# EAGLE schematic Testing_board_CIDIC_rev_aamaya (EAGLE 7.5.0)
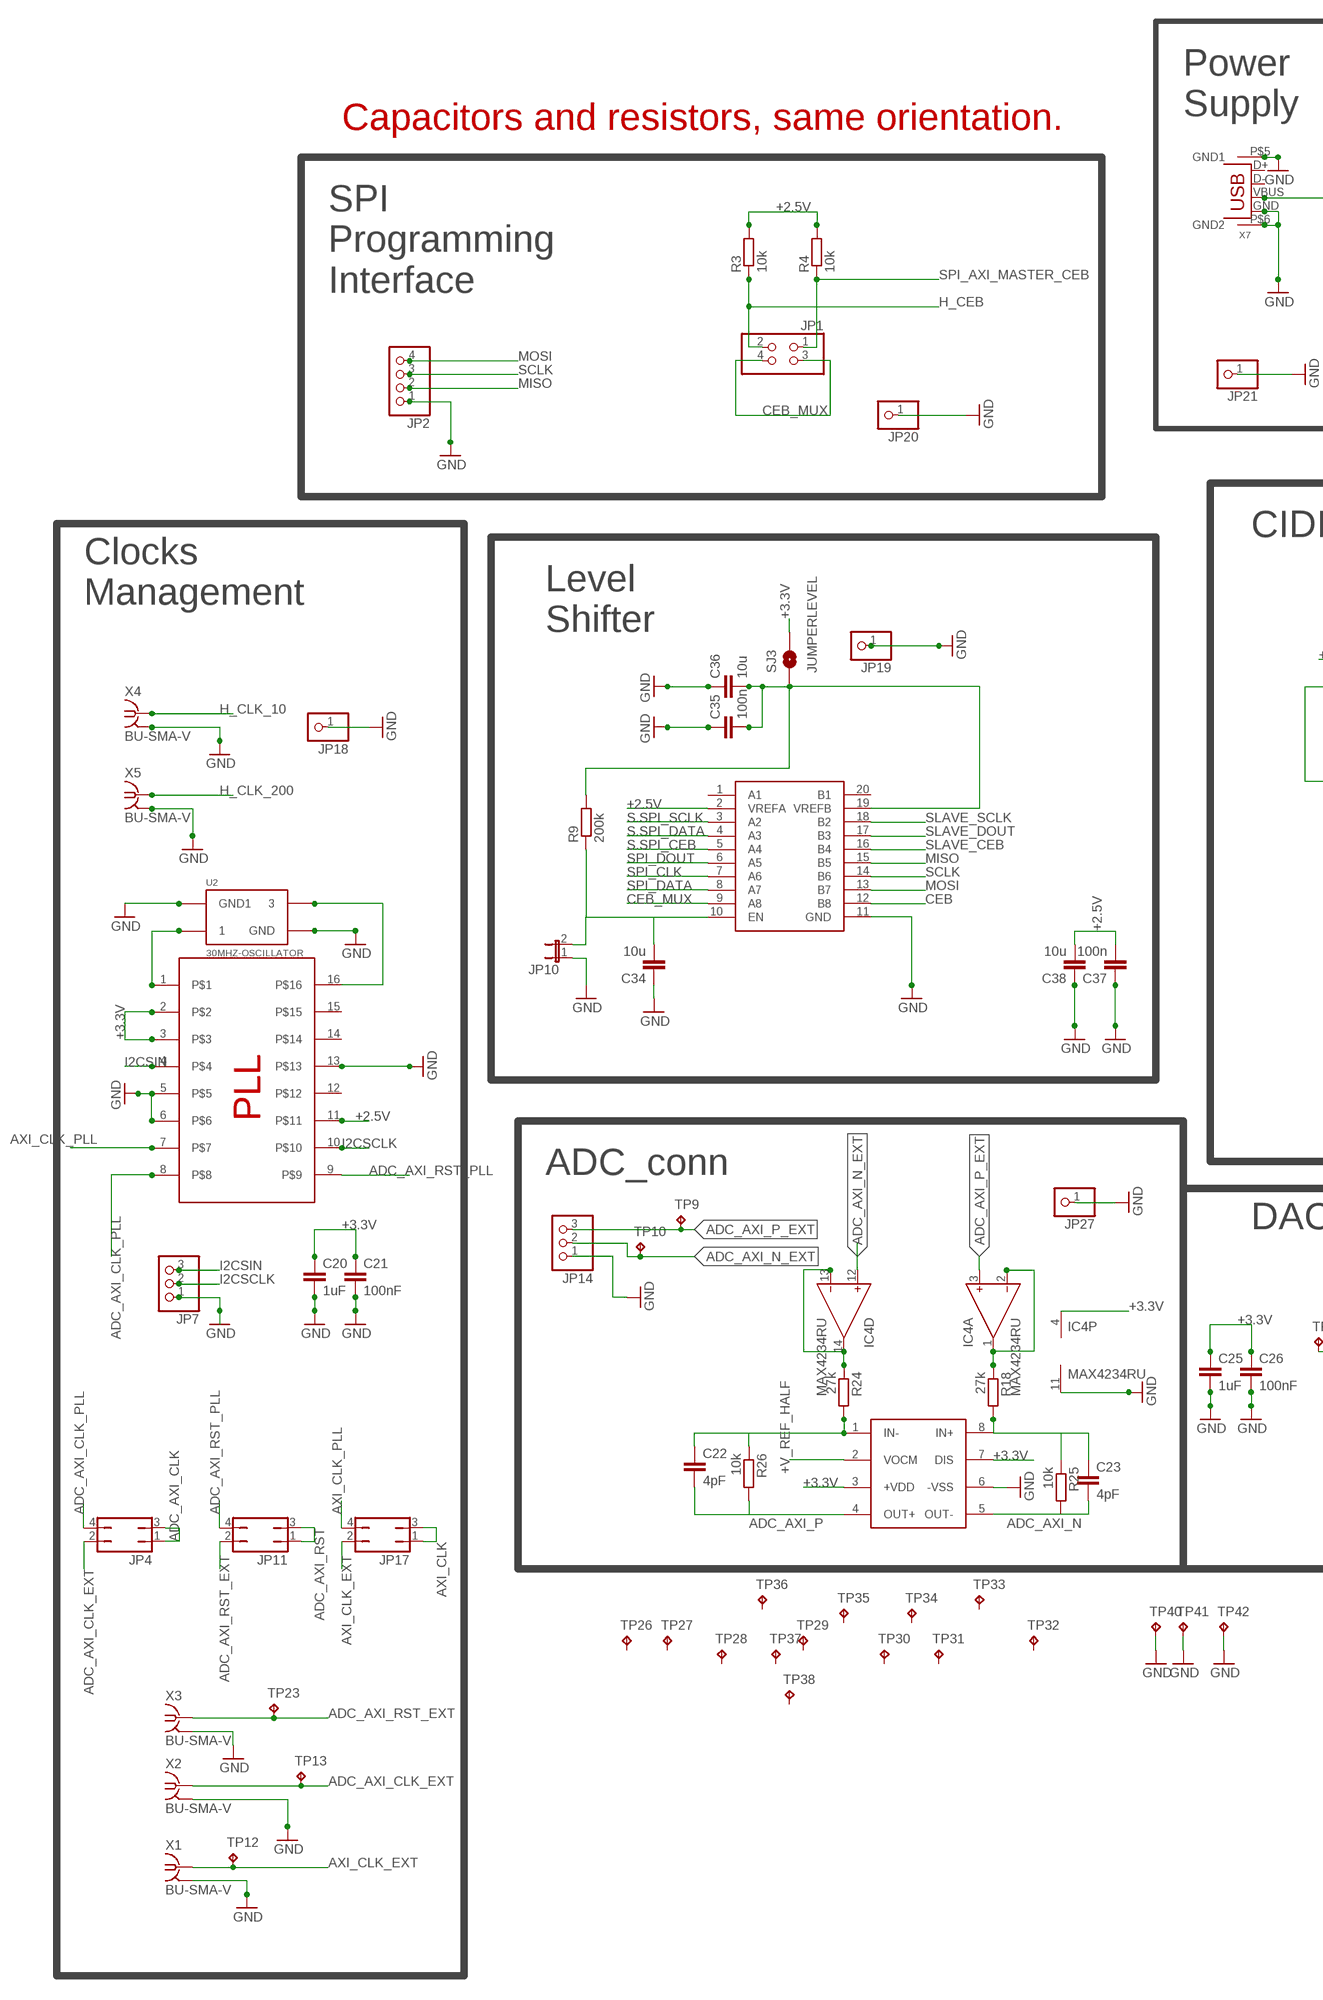
[diagram p0: schematic, sheet 1, part 1 of 2]
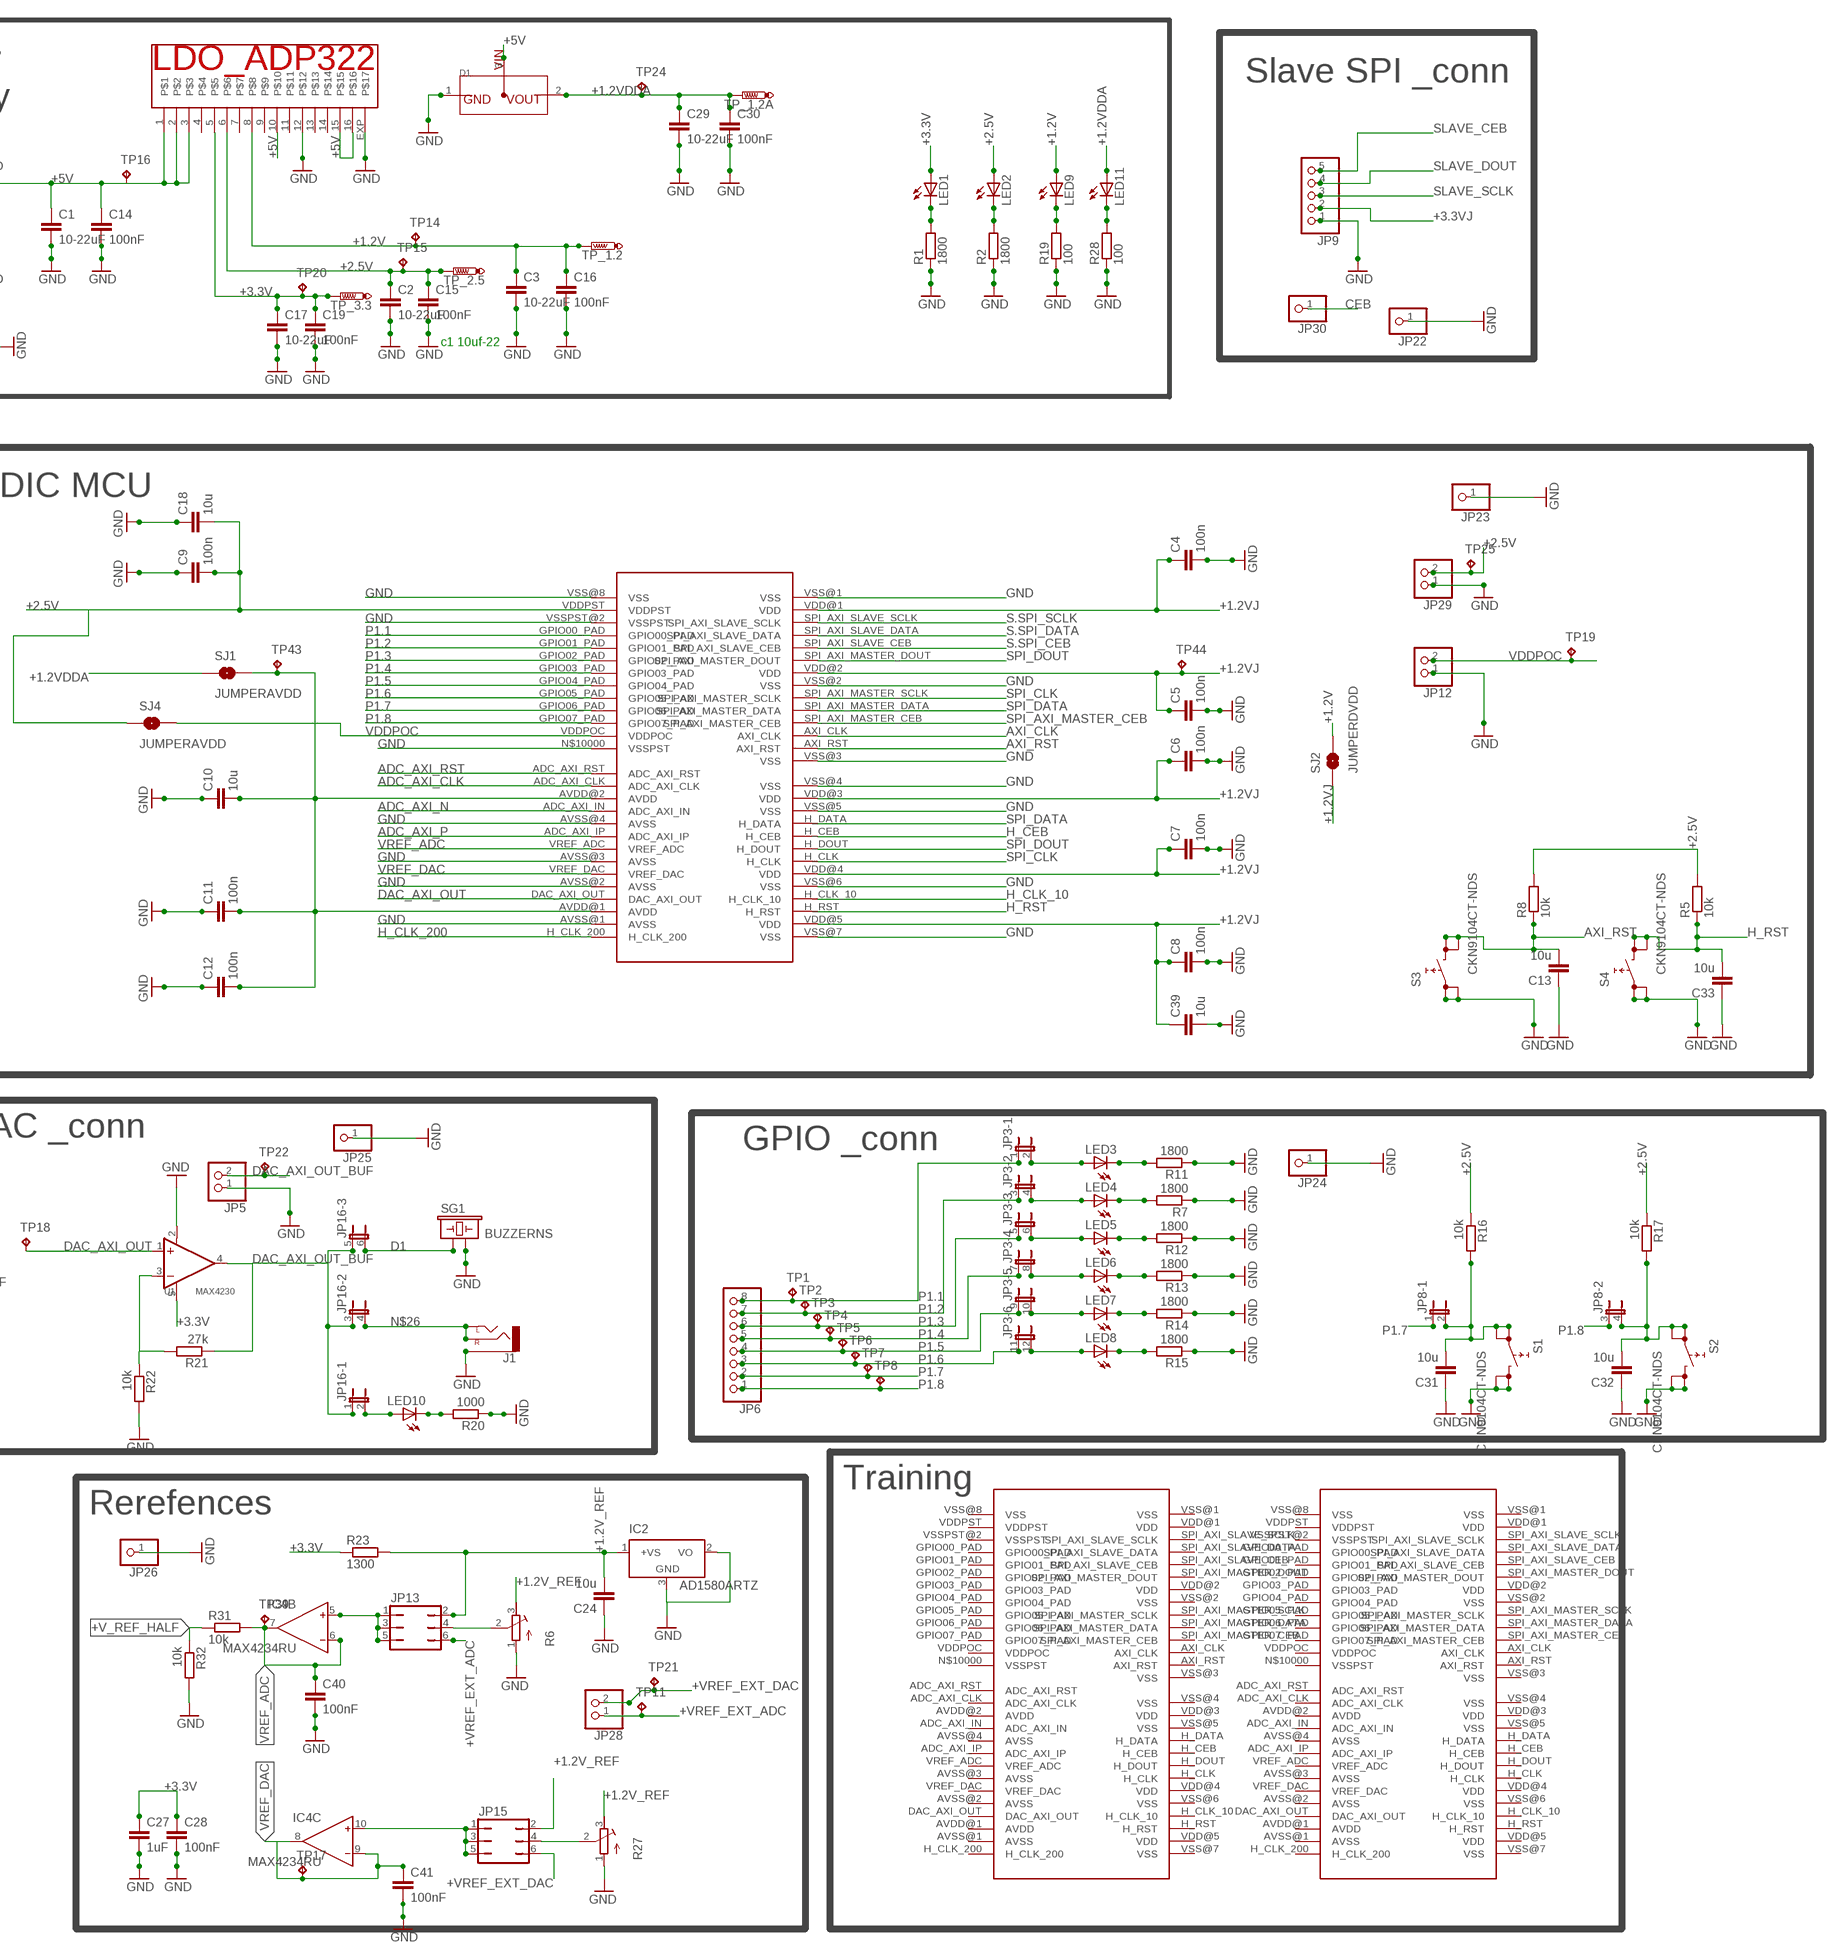
[diagram p1: schematic, sheet 1, part 2 of 2]

## Parts
C1  10-22uF  C-EUC0603  [C0603]
C2  10-22uF  C-EUC0603  [C0603]
C3  10-22uF  C-EUC0603  [C0603]
C4  100n  C-EUC0603  [C0603]
C5  100n  C-EUC0603  [C0603]
C6  100n  C-EUC0603  [C0603]
C7  100n  C-EUC0603  [C0603]
C8  100n  C-EUC0603  [C0603]
C9  100n  C-EUC0603  [C0603]
C10  10u  C-EUC0603  [C0603]
C11  100n  C-EUC0603  [C0603]
C12  100n  C-EUC0603  [C0603]
C13  10u  C-EUC0603  [C0603]
C14  100nF  C-EUC0603  [C0603]
C15  100nF  C-EUC0603  [C0603]
C16  100nF  C-EUC0603  [C0603]
C17  10-22uF  C-EUC0603  [C0603]
C18  10u  C-EUC0603  [C0603]
C19  100nF  C-EUC0603  [C0603]
C20  1uF  C-EUC0603  [C0603]
C21  100nF  C-EUC0603  [C0603]
C22  4pF  C-EUC0603  [C0603]
C23  4pF  C-EUC0603  [C0603]
C24  10u  C-EUC0603  [C0603]
C25  1uF  C-EUC0603  [C0603]
C26  100nF  C-EUC0603  [C0603]
C27  1uF  C-EUC0603  [C0603]
C28  100nF  C-EUC0603  [C0603]
C29  10-22uF  C-EUC0603  [C0603]
C30  100nF  C-EUC0603  [C0603]
C31  10u  C-EUC0603  [C0603]
C32  10u  C-EUC0603  [C0603]
C33  10u  C-EUC0603  [C0603]
C34  10u  C-EUC0603  [C0603]
C35  100n  C-EUC0603  [C0603]
C36  10u  C-EUC0603  [C0603]
C37  100n  C-EUC0603  [C0603]
C38  10u  C-EUC0603  [C0603]
C39  10u  C-EUC0603  [C0603]
C40  100nF  C-EUC0603  [C0603]
C41  100nF  C-EUC0603  [C0603]
D1  MCP1700T-1202E/TTCT-ND  [SOT-23]
GND  ADP322  [LFCSP_LQ-16]
IC2  AD1580ARTZ  LM50  [SOT23]
IC4  MAX4234RU  [TSSOP14]
J1  AUDIO-JACK_DIGIKEYSMD  [STEREOJACK2.5MM_SMD]
JP1  PINHD-2X2  [2X02]
JP2  PINHD-1X4  [1X04]
JP3  JP6QE  [JP6Q]
JP4  JP2Q  [JP2Q]
JP5  PINHD-1X2  [1X02]
JP6  PINHD-1X8  [1X08]
JP7  PINHD-1X3  [1X03]
JP8  JP2QE  [JP2Q]
JP9  PINHD-1X5  [1X05]
JP10  JP1E  [JP1]
JP11  JP2Q  [JP2Q]
JP12  PINHD-1X2  [1X02]
JP13  JP3Q  [JP3Q]
JP14  PINHD-1X3  [1X03]
JP15  JP3Q  [JP3Q]
JP16  JP3QE  [JP3Q]
JP17  JP2Q  [JP2Q]
JP18  PINHD-1X1  [1X01]
JP19  PINHD-1X1  [1X01]
JP20  PINHD-1X1  [1X01]
JP21  PINHD-1X1  [1X01]
JP22  PINHD-1X1  [1X01]
JP23  PINHD-1X1  [1X01]
JP24  PINHD-1X1  [1X01]
JP25  PINHD-1X1  [1X01]
JP26  PINHD-1X1  [1X01]
JP27  PINHD-1X1  [1X01]
JP28  PINHD-1X2  [1X02]
JP29  PINHD-1X2  [1X02]
JP30  PINHD-1X1  [1X01]
LED1  LEDSML0805  [SML0805]
LED2  LEDSML0805  [SML0805]
LED3  LEDCHIPLED_0805  [CHIPLED_0805]
LED4  LEDCHIPLED_0805  [CHIPLED_0805]
LED5  LEDCHIPLED_0805  [CHIPLED_0805]
LED6  LEDCHIPLED_0805  [CHIPLED_0805]
LED7  LEDCHIPLED_0805  [CHIPLED_0805]
LED8  LEDCHIPLED_0805  [CHIPLED_0805]
LED9  LEDSML0805  [SML0805]
LED10  LEDSML0805  [SML0805]
LED11  LEDSML0805  [SML0805]
R1  1800  R-EU_R0603  [R0603]
R2  1800  R-EU_R0603  [R0603]
R3  10k  R-EU_R0603  [R0603]
R4  10k  R-EU_R0603  [R0603]
R5  10k  R-EU_R0603  [R0603]
R6  R-TRIMM4G/J  [RTRIM4G/J]
R7  1800  R-EU_R0603  [R0603]
R8  10k  R-EU_R0603  [R0603]
R9  200k  R-EU_R0603  [R0603]
R11  1800  R-EU_R0603  [R0603]
R12  1800  R-EU_R0603  [R0603]
R13  1800  R-EU_R0603  [R0603]
R14  1800  R-EU_R0603  [R0603]
R15  1800  R-EU_R0603  [R0603]
R16  10k  R-EU_R0603  [R0603]
R17  10k  R-EU_R0603  [R0603]
R18  27k  R-EU_R0603  [R0603]
R19  100  R-EU_R0603  [R0603]
R20  1000  R-EU_R0603  [R0603]
R21  27k  R-EU_R0603  [R0603]
R22  10k  R-EU_R0603  [R0603]
R23  1300  R-EU_R0603  [R0603]
R24  27k  R-EU_R0603  [R0603]
R25  10k  R-EU_R0603  [R0603]
R26  10k  R-EU_R0603  [R0603]
R27  R-TRIMM4G/J  [RTRIM4G/J]
R28  100  R-EU_R0603  [R0603]
R31  10k  R-EU_R0603  [R0603]
R32  10k  R-EU_R0603  [R0603]
S1  CKN9104CT-NDS  [SKHMPXE010]
S2  CKN9104CT-NDS  [SKHMPXE010]
S3  CKN9104CT-NDS  [SKHMPXE010]
S4  CKN9104CT-NDS  [SKHMPXE010]
SG1  BUZZERNS  [BUZZER-12MM-NS]
SJ1  JUMPERAVDD  SOLDERJUMPERROUND  [SJ_ROUND]
SJ2  JUMPERDVDD  SOLDERJUMPERROUND  [SJ_ROUND]
SJ3  JUMPERLEVEL  SOLDERJUMPERROUND  [SJ_ROUND]
SJ4  JUMPERAVDD  SOLDERJUMPERROUND  [SJ_ROUND]
TP1  TPTP20R  [TP20R]
TP2  TPTP20R  [TP20R]
TP3  TPTP20R  [TP20R]
TP4  TPTP20R  [TP20R]
TP5  TPTP20R  [TP20R]
TP6  TPTP20R  [TP20R]
TP7  TPTP20R  [TP20R]
TP8  TPTP20R  [TP20R]
TP9  TPTP20R  [TP20R]
TP10  TPTP20R  [TP20R]
TP11  TPTP20R  [TP20R]
TP12  TPTP20R  [TP20R]
TP13  TPTP20R  [TP20R]
TP14  TPTP20R  [TP20R]
TP15  TPTP20R  [TP20R]
TP16  TPTP20R  [TP20R]
TP17  TPTP20R  [TP20R]
TP18  TPTP20R  [TP20R]
TP19  TPTP20R  [TP20R]
TP20  TPTP20R  [TP20R]
TP21  TPTP20R  [TP20R]
TP22  TPTP20R  [TP20R]
TP23  TPTP20R  [TP20R]
TP24  TPTP20R  [TP20R]
TP25  TPTP20R  [TP20R]
TP26  TPTP08R  [TP08R]
TP27  TPTP08R  [TP08R]
TP28  TPTP08R  [TP08R]
TP29  TPTP08R  [TP08R]
TP30  TPTP08R  [TP08R]
TP31  TPTP08R  [TP08R]
TP32  TPTP08R  [TP08R]
TP33  TPTP08R  [TP08R]
TP34  TPTP08R  [TP08R]
TP35  TPTP08R  [TP08R]
TP36  TPTP08R  [TP08R]
TP37  TPTP08R  [TP08R]
TP38  TPTP08R  [TP08R]
TP39  TPTP20R  [TP20R]
TP40  TPTP20R  [TP20R]
TP41  TPTP20R  [TP20R]
TP42  TPTP20R  [TP20R]
TP43  TPTP20R  [TP20R]
TP44  TPTP20R  [TP20R]
TP_1.2  PTR1B1,27  [B1,27]
TP_1.2A  PTR1B1,27  [B1,27]
TP_2.5  PTR1B1,27  [B1,27]
TP_3.3  PTR1B1,27  [B1,27]
U1  MAX4230  [SC-70-5]
U2  30MHZ-OSCILLATOR  [5X3.2]
U$1  CIDIC_AXI_UC_TEST_DIE  [CIDIC_AXI_UC_TEST_DIE]
U$3  LEVEL_SHIFTER_8  [TSSOP20]
U$4  CY22150KFZXC  [TSSOP16]
U$5  ADA4940  [SO8]
U$6  CIDIC_AXI_UC_TEST_DIE  [CIDIC_AXI_UC_TEST_DIE]
U$7  CIDIC_AXI_UC_TEST_DIE  [CIDIC_AXI_UC_TEST_DIE]
X1  BU-SMA-V  [BU-SMA-V]
X2  BU-SMA-V  [BU-SMA-V]
X3  BU-SMA-V  [BU-SMA-V]
X4  BU-SMA-V  [BU-SMA-V]
X5  BU-SMA-V  [BU-SMA-V]
X7  USB-A-H  [USB-A-H]

## Nets
+1.2V: C3.1 C16.1 GND.8 LED9.A SJ2.2 TP14.TP TP_1.2.TP
+1.2V_REF: C24.2 IC2.1(+VS) JP13.2 JP15.2 R6.3(E) R23.2 R27.3(E)
+1.2VDDA: C29.1 C30.1 D1.2(VOUT) LED11.A SJ1.1 TP24.TP TP_1.2A.TP
+1.2VJ: C4.1 C5.1 C6.1 C7.1 C8.1 C39.1 SJ2.1 TP44.TP U$1.VDD@1(VDD) U$1.VDD@2(VDD) U$1.VDD@3(VDD) U$1.VDD@4(VDD) U$1.VDD@5(VDD)
+2.5V: C2.1 C9.2 C15.1 C18.2 C37.2 C38.2 GND.6 JP29.2 LED2.A R3.2 R4.2 R5.2 R8.2 R16.1 R17.1 SJ4.1 TP15.TP TP25.TP TP_2.5.TP U$1.VDDPST U$3.2(VREFA) U$4.11
+3.3V: C17.1 C19.1 C20.1 C21.1 C25.1 C26.1 C27.1 C28.1 GND.5 IC4.4(P:V+) LED1.A R23.1 SJ3.2 TP20.TP TP_3.3.TP U1.5(V+) U$4.2 U$4.3 U$5.3(+VDD) U$5.7(DIS)
+3.3VJ: C35.2 C36.2 JP9.2 R9.2 SJ3.1 U$3.19(VREFB)
+5V: C1.1 C14.1 D1.3(VIN) GND.1 GND.2 GND.3 GND.10 GND.15 GND.16 TP16.TP X7.VBUS
+V_REF_HALF: R31.1 R32.1 U$5.2(VOCM)
+VREF_EXT_ADC: JP13.6 JP28.1 TP11.TP
+VREF_EXT_DAC: JP15.6 JP28.2 TP21.TP
ADC_AXI_CLK: JP4.1 JP4.3 U$1.ADC_AXI_CLK
ADC_AXI_CLK_EXT: JP4.2 TP13.TP X2.1
ADC_AXI_CLK_PLL: JP4.4 U$4.8
ADC_AXI_N: C23.2 R25.2 U$1.ADC_AXI_IN U$5.5(OUT-)
ADC_AXI_N_EXT: IC4.12(D:IN+) JP14.2 TP10.TP
ADC_AXI_P: C22.2 R26.2 U$1.ADC_AXI_IP U$5.4(OUT+)
ADC_AXI_P_EXT: IC4.3(A:IN+) JP14.3 TP9.TP
ADC_AXI_RST: JP11.1 JP11.3 U$1.ADC_AXI_RST
ADC_AXI_RST_EXT: JP11.2 TP23.TP X3.1
ADC_AXI_RST_PLL: JP11.4 U$4.9
AXI_CLK: JP17.1 JP17.3 U$1.AXI_CLK
AXI_CLK_EXT: JP17.2 TP12.TP X1.1
AXI_CLK_PLL: JP17.4 U$4.7
AXI_RST: C13.2 R8.1 S3.3(2.1) S3.4(2.2) U$1.AXI_RST
CEB: JP30.1 U$3.12(B8)
CEB_MUX: JP1.3 JP1.4 U$3.9(A8)
D1: JP16.6 SG1.+
D3: JP16.2 LED10.A
DAC_AXI_OUT: TP18.TP U1.1(IN+) U$1.DAC_AXI_OUT
DAC_AXI_OUT_BUF: JP5.2 JP16.1 JP16.3 JP16.5 R21.1 TP22.TP U1.4(OUT)
GND: C1.2 C2.2 C3.2 C4.2 C5.2 C6.2 C7.2 C8.2 C9.1 C10.1 C11.1 C12.1 C13.1 C14.2 C15.2 C16.2 C17.2 C18.1 C19.2 C20.2 C21.2 C24.1 C25.2 C26.2 C27.2 C28.2 C29.2 C30.2 C31.1 C32.1 C33.1 C34.1 C35.1 C36.1 C37.1 C38.1 C39.2 C40.2 C41.2 D1.1(GND) GND.12 GND.EXP IC2.2(VO) IC2.3(GND) IC4.11(P:V-) J1.1(SLEEVE) JP2.1 JP5.1 JP7.1 JP9.1 JP10.1 JP12.1 JP14.1 JP18.1 JP19.1 JP20.1 JP21.1 JP22.1 JP23.1 JP24.1 JP25.1 JP26.1 JP27.1 JP29.1 R1.1 R2.1 R6.1(A) R7.1 R11.1 R12.1 R13.1 R14.1 R15.1 R19.1 R20.1 R22.2 R27.1(A) R28.1 R32.2 S1.3(2.1) S1.4(2.2) S2.3(2.1) S2.4(2.2) S3.1(1.1) S3.2(1.2) S4.1(1.1) S4.2(1.2) SG1.- TP40.TP TP41.TP TP42.TP U1.2(V-) U2.2(GND) U2.4(GND1) U$1.AVSS@1(AVSS) U$1.AVSS@2(AVSS) U$1.AVSS@3(AVSS) U$1.AVSS@4(AVSS) U$1.N$10000(VSSPST) U$1.VSS@1(VSS) U$1.VSS@2(VSS) U$1.VSS@3(VSS) U$1.VSS@4(VSS) U$1.VSS@5(VSS) U$1.VSS@6(VSS) U$1.VSS@7(VSS) U$1.VSS@8(VSS) U$1.VSSPST@2(VSSPST) U$3.11(GND) U$4.5 U$4.6 U$4.13 U$5.6(-VSS) X1.2 X1.3 X1.4 X1.5 X2.2 X2.3 X2.4 X2.5 X3.2 X3.3 X3.4 X3.5 X4.2 X4.3 X4.4 X4.5 X5.2 X5.3 X5.4 X5.5 X7.GND X7.P$5(GND1) X7.P$6(GND2)
H_CEB: JP1.2 R3.1 U$1.H_CEB
H_CLK_10 [diff_pair]: U$1.H_CLK_10 X4.1
H_CLK_200 [diff_pair]: U$1.H_CLK_200 X5.1
H_RST: C33.2 R5.1 S4.3(2.1) S4.4(2.2) U$1.H_RST
I2CSCLK: JP7.2 U$4.10
I2CSIN: JP7.3 U$4.4
JV12A: C10.2 C11.2 C12.2 SJ1.2 TP43.TP U$1.AVDD@1(AVDD) U$1.AVDD@2(AVDD)
MISO: JP2.2 U$3.15(B5)
MOSI: JP2.4 U$3.13(B7)
N$1: U2.1 U$4.1
N$2: LED1.C R1.2
N$3: LED2.C R2.2
N$4: C22.1 R24.2 R26.1 U$5.1(IN-)
N$5: LED9.C R19.2
N$6: C31.2 JP8.2 R16.2 S1.1(1.1) S1.2(1.2)
N$7: C32.2 JP8.4 R17.2 S2.1(1.1) S2.2(1.2)
N$8: C23.1 R18.2 R25.1 U$5.8(IN+)
N$9: U2.3 U$4.16
N$10: JP13.4 R6.2(S)
N$12: LED11.C R28.2
N$13: IC4.13(D:IN-) IC4.14(D:OUT) R24.1
N$14: LED4.C R7.2
N$15: JP3.4 LED4.A
N$16: JP3.6 LED5.A
N$17: JP3.8 LED6.A
N$18: JP3.10 LED7.A
N$19: JP3.2 LED3.A
N$20: LED3.C R11.2
N$21: JP3.12 LED8.A
N$22: LED5.C R12.2
N$23: LED6.C R13.2
N$24: LED7.C R14.2
N$25: LED8.C R15.2
N$26: J1.2(LEFT) J1.3(RIGHT) JP16.4
N$27: IC4.1(A:OUT) IC4.2(A:IN-) R18.1
N$29: R21.2 R22.1 U1.3(IN-)
N$31: LED10.C R20.2
N$33: IC4.10(C:IN+) JP15.1 JP15.3 JP15.5
N$36: IC4.5(B:IN+) JP13.1 JP13.3 JP13.5
N$37: JP15.4 R27.2(S)
N$53: C34.2 JP10.2 R9.1 U$3.10(EN)
P1.1: JP3.1 JP6.8 TP1.TP U$1.GPIO00_PAD
P1.2: JP3.3 JP6.7 TP2.TP U$1.GPIO01_PAD
P1.3: JP3.5 JP6.6 TP3.TP U$1.GPIO02_PAD
P1.4: JP3.7 JP6.5 TP4.TP U$1.GPIO03_PAD
P1.5: JP3.9 JP6.4 TP5.TP U$1.GPIO04_PAD
P1.6: JP3.11 JP6.3 TP6.TP U$1.GPIO05_PAD
P1.7: JP6.2 JP8.1 TP7.TP U$1.GPIO06_PAD
P1.8: JP6.1 JP8.3 TP8.TP U$1.GPIO07_PAD
S.SPI_CEB: U$1.SPI_AXI_SLAVE_CEB U$3.5(A4)
S.SPI_DATA: U$1.SPI_AXI_SLAVE_DATA U$3.4(A3)
S.SPI_SCLK: U$1.SPI_AXI_SLAVE_SCLK U$3.3(A2)
SCLK: JP2.3 U$3.14(B6)
SLAVE_CEB: JP9.5 U$3.16(B4)
SLAVE_DOUT: JP9.4 U$3.17(B3)
SLAVE_SCLK: JP9.3 U$3.18(B2)
SPI_AXI_MASTER_CEB: JP1.1 R4.1 U$1.SPI_AXI_MASTER_CEB
SPI_CLK: U$1.H_CLK U$1.SPI_AXI_MASTER_SCLK U$3.7(A6)
SPI_DATA: U$1.H_DATA U$1.SPI_AXI_MASTER_DATA U$3.8(A7)
SPI_DOUT: U$1.H_DOUT U$1.SPI_AXI_MASTER_DOUT U$3.6(A5)
VDDPOC: JP12.2 SJ4.2 TP19.TP U$1.VDDPOC
VREF_ADC: C40.1 IC4.6(B:IN-) IC4.7(B:OUT) R31.2 TP39.TP U$1.VREF_ADC
VREF_DAC: C41.1 IC4.8(C:OUT) IC4.9(C:IN-) TP17.TP U$1.VREF_DAC
Unconnected: GND.4 GND.7 GND.9 GND.11 GND.13 GND.14 TP26.TP TP27.TP TP28.TP TP29.TP TP30.TP TP31.TP TP32.TP TP33.TP TP34.TP TP35.TP TP36.TP TP37.TP TP38.TP U$3.1(A1) U$3.20(B1) U$4.12 U$4.14 U$4.15 U$6.ADC_AXI_CLK U$6.ADC_AXI_IN U$6.ADC_AXI_IP U$6.ADC_AXI_RST U$6.AVDD@1(AVDD) U$6.AVDD@2(AVDD) U$6.AVSS@1(AVSS) U$6.AVSS@2(AVSS) U$6.AVSS@3(AVSS) U$6.AVSS@4(AVSS) U$6.AXI_CLK U$6.AXI_RST U$6.DAC_AXI_OUT U$6.GPIO00_PAD U$6.GPIO01_PAD U$6.GPIO02_PAD U$6.GPIO03_PAD U$6.GPIO04_PAD U$6.GPIO05_PAD U$6.GPIO06_PAD U$6.GPIO07_PAD U$6.H_CEB U$6.H_CLK U$6.H_CLK_10 U$6.H_CLK_200 U$6.H_DATA U$6.H_DOUT U$6.H_RST U$6.N$10000(VSSPST) U$6.SPI_AXI_MASTER_CEB U$6.SPI_AXI_MASTER_DATA U$6.SPI_AXI_MASTER_DOUT U$6.SPI_AXI_MASTER_SCLK U$6.SPI_AXI_SLAVE_CEB U$6.SPI_AXI_SLAVE_DATA U$6.SPI_AXI_SLAVE_SCLK U$6.VDD@1(VDD) U$6.VDD@2(VDD) U$6.VDD@3(VDD) U$6.VDD@4(VDD) U$6.VDD@5(VDD) U$6.VDDPOC U$6.VDDPST U$6.VREF_ADC U$6.VREF_DAC U$6.VSS@1(VSS) U$6.VSS@2(VSS) U$6.VSS@3(VSS) U$6.VSS@4(VSS) U$6.VSS@5(VSS) U$6.VSS@6(VSS) U$6.VSS@7(VSS) U$6.VSS@8(VSS) U$6.VSSPST@2(VSSPST) U$7.ADC_AXI_CLK U$7.ADC_AXI_IN U$7.ADC_AXI_IP U$7.ADC_AXI_RST U$7.AVDD@1(AVDD) U$7.AVDD@2(AVDD) U$7.AVSS@1(AVSS) U$7.AVSS@2(AVSS) U$7.AVSS@3(AVSS) U$7.AVSS@4(AVSS) U$7.AXI_CLK U$7.AXI_RST U$7.DAC_AXI_OUT U$7.GPIO00_PAD U$7.GPIO01_PAD U$7.GPIO02_PAD U$7.GPIO03_PAD U$7.GPIO04_PAD U$7.GPIO05_PAD U$7.GPIO06_PAD U$7.GPIO07_PAD U$7.H_CEB U$7.H_CLK U$7.H_CLK_10 U$7.H_CLK_200 U$7.H_DATA U$7.H_DOUT U$7.H_RST U$7.N$10000(VSSPST) U$7.SPI_AXI_MASTER_CEB U$7.SPI_AXI_MASTER_DATA U$7.SPI_AXI_MASTER_DOUT U$7.SPI_AXI_MASTER_SCLK U$7.SPI_AXI_SLAVE_CEB U$7.SPI_AXI_SLAVE_DATA U$7.SPI_AXI_SLAVE_SCLK U$7.VDD@1(VDD) U$7.VDD@2(VDD) U$7.VDD@3(VDD) U$7.VDD@4(VDD) U$7.VDD@5(VDD) U$7.VDDPOC U$7.VDDPST U$7.VREF_ADC U$7.VREF_DAC U$7.VSS@1(VSS) U$7.VSS@2(VSS) U$7.VSS@3(VSS) U$7.VSS@4(VSS) U$7.VSS@5(VSS) U$7.VSS@6(VSS) U$7.VSS@7(VSS) U$7.VSS@8(VSS) U$7.VSSPST@2(VSSPST) X7.D+ X7.D-

## Notes on the sheet
- LDO_ADP322
- Slave SPI _conn
- Power 
  Supply
- Capacitors and resistors, same orientation.
- SPI
  Programming 
  Interface
- c1 10uf-22
- CIDIC MCU
- Clocks
  Management
- Level
  Shifter
- PLL
- ADC_conn
- DAC _conn
- GPIO _conn
- Training
- Rerefences

## Library data of the parts
C1-C41 = rcl:C-EU: CAPACITOR, European symbol
D1 = LDO:MCP1700T-1202E/TTCT-ND: MCP1700T-1202E/TTCT-ND
GND = reg1:ADP322
IC2 = linear:LM50: SOT-23 Single-Supply Centigrade Temperature Sensor Vout = (10mV/°C x Temp °C) +5mmmV Source: http://cache.national.com/ds/LM/LM50.pdf
IC4 = opamp:MAX4234: Precision Micropower, Low Noise CMOS, Rail-to-Rail Input/Output Operational Amplifiers Source: http://www.analog.com/static/imported-files/data_sheets/AD8603_8607_8609.pdf; MF: ALTERA CORPORATION; MPN: AD8609ARUZ; OC_FARNELL: 1464994; OC_NEWARK: 59K6934
J1 = audio-jack_digikey:AUDIO-JACK_DIGIKEY: 3.5mm Audio Jack Simple 3.5mm common PCB mount audio jack. Variant PTH is our storefront SKU PRT-08032; PROD_ID: CONN-10062
JP1 = pinhead:PINHD-2X2: PIN HEADER
JP2 = pinhead:PINHD-1X4: PIN HEADER
JP3 = jumper:JP6QE: JUMPER
JP4 JP11 JP17 = jumper:JP2Q: JUMPER
JP5 JP12 JP28 JP29 = pinhead:PINHD-1X2: PIN HEADER
JP6 = pinhead:PINHD-1X8: PIN HEADER
JP7 JP14 = pinhead:PINHD-1X3: PIN HEADER
JP8 = jumper:JP2QE: JUMPER
JP9 = pinhead:PINHD-1X5: PIN HEADER
JP10 = jumper:JP1E: JUMPER
JP13 JP15 = jumper:JP3Q: JUMPER
JP16 = jumper:JP3QE: JUMPER
JP18-JP27 JP30 = pinhead:PINHD-1X1: PIN HEADER
LED1-LED11 = led:LED: LED OSRAM: - CHIPLED LG R971, LG N971, LY N971, LG Q971, LY Q971, LO R971, LY R971 LH N974, LH R974 LS Q976, LO Q976, LY Q976 LO Q996 - Hyper CHIPLED LW Q18S LB Q993, LB Q99A, LB R99A - SideLED LS A670, LO A670, LY A670, LG A670, LP A670 LB A673, LV A673, LT A673, LW A673 LH A674 LY A675 LS A676, LA A676, LO A676, LY A676, LW A676 LS A679, LY A679, LG A679 - Hyper Micro SIDELED® LS Y876, LA Y876, LO Y876, LY Y876 LT Y87S - SmartLED LW L88C, LW L88S LB L89C, LB L89S, LG L890 LS L89K, LO L89K, LY L89K LS L896, LA L896, LO L896, LY L896 - TOPLED LS T670, LO T670, LY T670, LG T670, LP T670 LSG T670, LSP T670, LSY T670, LOP T670, LYG T670 LG T671, LOG T671, LSG T671 LB T673, LV T673, LT T673, LW T673 LH T674 LS T676, LA T676, LO T676, LY T676, LB T676, LH T676, LSB T676, LW T676 LB T67C, LV T67C, LT T67C, LS T67K, LO T67K, LY T67K, LW E67C LS E67B, LA E67B, LO E67B, LY E67B, LB E67C, LV E67C, LT E67C LW T67C LS T679, LY T679, LG T679 LS T770, LO T770, LY T770, LG T770, LP T770 LB T773, LV T773, LT T773, LW T773 LH T774 LS E675, LA E675, LY E675, LS T675 LS T776, LA T776, LO T776, LY T776, LB T776 LHGB T686 LT T68C, LB T68C - Hyper Mini TOPLED® LB M676 - Mini TOPLED Santana® LG M470 LS M47K, LO M47K, LY M47K Source: http://www.osram.convergy.de LUXEON: - LUMILED® LXK2-PW12-R00, LXK2-PW12-S00, LXK2-PW14-U00, LXK2-PW14-V00 LXK2-PM12-R00, LXK2-PM12-S00, LXK2-PM14-U00 LXK2-PE12-Q00, LXK2-PE12-R00, LXK2-PE12-S00, LXK2-PE14-T00, LXK2-PE14-U00 LXK2-PB12-K00, LXK2-PB12-L00, LXK2-PB12-M00, LXK2-PB14-N00, LXK2-PB14-P00, LXK2-PB14-Q00 LXK2-PR12-L00, LXK2-PR12-M00, LXK2-PR14-Q00, LXK2-PR14-R00 LXK2-PD12-Q00, LXK2-PD12-R00, LXK2-PD12-S00 LXK2-PH12-R00, LXK2-PH12-S00 LXK2-PL12-P00, LXK2-PL12-Q00, LXK2-PL12-R00 Source: www.luxeon.com KINGBRIGHT: KA-3528ASYC Source: www.kingbright.com
R1-R5 R7-R9 R11-R26 R28 R31 R32 = rcl:R-EU_: RESISTOR, European symbol
R6 R27 = resistor:R-TRIMM: Trimm resistor
S1-S4 = switch_hg:CKN9104CT-ND: http://www.digikey.com/product-detail/en/c-k-components/PTS525SM15SMTR2-LFS/CKN9104CT-ND/1146923
SG1 = SparkFun-Electromechanical:BUZZER: Buzzer 12mm Spark Fun Electronics SKU : Comp-Buzzer
SJ1-SJ4 = SparkFun-Retired:SOLDERJUMPER: Solder Jumper Standard SMD solder jumper. Used to automate production. Two varients : Normally Open and Normally Closed are the same, but have different paste layers. NC will have a large amount of paste and should jumper during reflow.
TP1-TP44 = testpad:TP: Test pad
TP_1.2 TP_1.2A TP_2.5 TP_3.3 = testpad:PTR1: TEST PIN
U1 = opamp:MAX4230: 310020013; MPN: LMV321IDCKR; VALUE: LMV321IDCKR-sc70-5
U2 = crystal30:30MHZ-OSCILLATOR: Generic 5x3.2 Oscillator; PROD_ID: XTAL-11986
U$1 U$6 U$7 = tsmc130_AXI_uC2:CIDIC_AXI_UC_TEST_DIE
U$3 = level_shifter:LEVEL_SHIFTER_8
U$4 = CY22150KFZXC:CY22150KFZXC
U$5 = analog_microAXI:ADA4940
X1-X5 = con-coax:BU-SMA-V: FEMALE SMA CONNECTOR Radiall distributor RS 112-3794; OC_FARNELL: unknown; OC_NEWARK: unknown
X7 = con-usb-3:USB: USB Connectors

## Net classes
1 diff_pair: width 0.152 mm